# EAGLE design Adafruit Latching Relay FeatherWing (EAGLE 6.6.0)
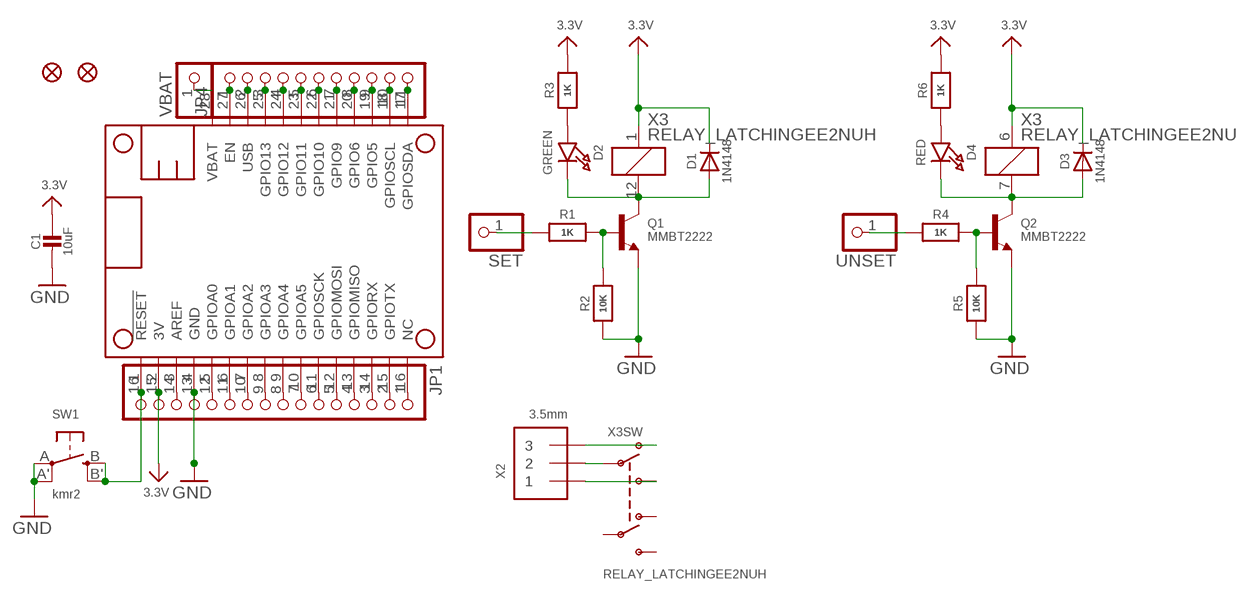
[diagram p0: schematic, sheet 1]

## Parts
C1  10uF  CAP_CERAMIC0805-NOOUTLINE  [0805-NO]
D1  1N4148  DIODESOD-323  [SOD-323]
D2  GREEN  LED0805_NOOUTLINE  [CHIPLED_0805_NOOUTLINE]
D3  1N4148  DIODESOD-323  [SOD-323]
D4  RED  LED0805_NOOUTLINE  [CHIPLED_0805_NOOUTLINE]
FID2  FIDUCIAL""  [FIDUCIAL_1MM]
FID3  FIDUCIAL""  [FIDUCIAL_1MM]
JP1  HEADER-1X16ROUND  [1X16_ROUND]
JP4  HEADER-1X11  [1X11_ROUND]
MS1  MICROSHIELD  [MICROSHIELD]
Q1  MMBT2222  TRANSISTOR_NPN  [SOT23-R]
Q2  MMBT2222  TRANSISTOR_NPN  [SOT23-R]
R1  1K  RESISTOR0805_NOOUTLINE  [0805-NO]
R2  10K  RESISTOR0805_NOOUTLINE  [0805-NO]
R3  1K  RESISTOR0805_NOOUTLINE  [0805-NO]
R4  1K  RESISTOR0805_NOOUTLINE  [0805-NO]
R5  10K  RESISTOR0805_NOOUTLINE  [0805-NO]
R6  1K  RESISTOR0805_NOOUTLINE  [0805-NO]
SET  HEADER-1X1ROUND  [1X01_ROUND]
SW1  kmr2  SWITCH_TACT_SMT4.6X2.8  [BTN_KMR2_4.6X2.8]
UNSET  HEADER-1X1ROUND  [1X01_ROUND]
VBAT  HEADER-1X1ROUND  [1X01_ROUND]
X2  3.5mm  TERMBLOCK_1X3  [TERMBLOCK_1X3-3.5MM]
X3  RELAY_LATCHINGEE2NUH  [RELAY_EE2_LATCH]

## Nets
3.3V: C1.1 D1.C D3.C JP1.15 MS1.2(3V) R3.2 R6.2 X3.1 X3.6
COM1 [HV]: X2.2 X3.9(SW:P1)
GND: C1.2 JP1.13 MS1.4(GND) Q1.2(E) Q2.2(E) R2.1 R5.1 SW1.A'(P1) SW1.A(P)
N$1: D1.A D2.C Q1.3(C) X3.12
N$2: JP1.1 MS1.16(NC)
N$3: JP1.2 MS1.15(GPIOTX)
N$4: JP1.3 MS1.14(GPIORX)
N$5: JP1.4 MS1.13(GPIOMISO)
N$6: JP1.5 MS1.12(GPIOMOSI)
N$7: JP1.6 MS1.11(GPIOSCK)
N$8: JP1.7 MS1.10(GPIOA5)
N$9: JP1.8 MS1.9(GPIOA4)
N$10: JP1.9 MS1.8(GPIOA3)
N$11: JP1.10 MS1.7(GPIOA2)
N$12: JP1.11 MS1.6(GPIOA1)
N$13: JP1.12 MS1.5(GPIOA0)
N$14: JP4.1 MS1.27(EN)
N$15: JP4.3 MS1.25(GPIO13)
N$16: JP4.4 MS1.24(GPIO12)
N$17: JP4.5 MS1.23(GPIO11)
N$18: JP4.6 MS1.22(GPIO10)
N$19: JP4.7 MS1.21(GPIO9)
N$20: JP4.8 MS1.20(GPIO6)
N$21: JP4.9 MS1.19(GPIO5)
N$22: Q1.1(B) R1.2 R2.2
N$23: JP1.14 MS1.3(AREF)
N$24: R1.1 SET.1
N$25: D3.A D4.C Q2.3(C) X3.7
N$26: D2.A R3.1
N$27: Q2.1(B) R4.2 R5.2
N$28 [HV]: X2.3 X3.10(SW:O1)
N$29: R4.1 UNSET.1
N$30: D4.A R6.1
NO1 [HV]: X2.1 X3.8(SW:S1)
RESET: JP1.16 MS1.1(!RESET) SW1.B'(S1) SW1.B(S)
SCL: JP4.10 MS1.18(GPIOSCL)
SDA: JP4.11 MS1.17(GPIOSDA)
USB: JP4.2 MS1.26(USB)
VBAT: MS1.28(VBAT) VBAT.1
Unconnected: X3.3(SW:O2) X3.4(SW:P2) X3.5(SW:S2)

## Library data of the parts
C1 = microbuilder:CAP_CERAMIC: Ceramic Capacitors For new designs, use the packages preceded by an '_' character since they are more reliable: The following footprints should be used on most boards: _0402 - Standard footprint for regular board layouts _0603 - Standard footprint for regular board layouts _0805 - Standard footprint for regular board layouts _1206 - Standard footprint for regular board layouts For extremely tight-pitch boards where space is at a premium, the following 'micro-pitch' footprints can be used (smaller pads, no silkscreen outline, etc.): _0402MP - Micro-pitch footprint for very dense/compact boards _0603MP - Micro-pitch footprint for very dense/compact boards _0805MP - Micro-pitch footprint for very dense/compact boards _1206MP - Micro-pitch footprint for very dense/compact boards
D1 D3 = microbuilder:DIODE: Diode SMA Model Volts Amps Type Vf Ir Digikey # Notes SSA34-E3 40V 3A Schottky 480mV @ 3A 200uA @ 40V SSA34-E3/61TGITR-ND CDBA120-G 20V 1A Schottky 500mV @ 1A 500uA @ 20V 641-1014-6-ND REEL MBRA210 10V 2A Schottky 350mV @ 2A 700uA @ 10V MBRA210LT3 SOD-123 Model Volts Amps Type Vf Ir Order # Notes BAT54T1G 30V 200mA Schottky 800mV @ 200mA 2uA @ 25V BAT54T1GOSTR-ND B0530W 30V 500mA Schottky 430mV @ 500mA 130uA @ 30V B0530W-FDICT-ND REEL MBR120 20V 1A Schottky 340mV @ 1A MBR120VLSFT1GOSCT-ND SOD-323 Model Volts Amps Type Vf Ir Order # Notes PMEG2005EJ 20V 500mA Schottky 355mV @ 500mA 568-4110-1-ND ZLLS410 10V 570mA Schottky 380mV @ 570mA ZLLS410CT-ND 1N4148WS 75V 150mA Silicon/Simple 1V 1N4148WSFSCT-ND REEL SOD-523 Model Volts Amps Type Vf Ir Order # Notes BAT54XV2 30V 200mA Schottky 0.8V @ 100mA BAT54XV2CT-ND TB751S 30V 30mA Schottky RB751S-40TE61CT-ND SOT23-R/W (R = Solder Paste/Reflow Ovens, W = Hand-Soldering) Model Volts Amps Type Vf Ir Order # Notes BAT54FILM 40V 300mA Schottky 497-7162-1-ND POWERDI-5 Model Volts Amps Type Vf Ir Order # Notes PDS560 60V 5A Schottky 670mV @ 5A 150uA @ 60V PDS560DICT-ND
D2 D4 = microbuilder:LED: LED 0603 - 0603 Surface Mount Package 2mA: Green LED - Low Power (3.9mcd, 2ma, 1.7Vf) - Digikey: 475-2709-2-ND Orange LED - Low Power (9.8mcd, 2ma, 1.8Vf) - Digikey: 475-1194-2-ND Red LED - Low Power (5mcd, 2ma, 1.8Vf) - Digikey: 475-1195-2-ND Yellow LED - Low Power (7mcd, 2ma, 1.8Vf) - Digikey: 475-1196-2-ND 5mA: Blue LED - Low Power (17mcd, 5ma, 2.9Vf) - Digikey: LNJ937W8CRACT-ND 0805 - 0805 Surface Mount Package 2mA: Red LED (8.8mcd, 2mA, 1.8Vf, Clear) - Low Power [Digikey: 475-2510-1-ND] Green LED (5mcd, 2mA, 1.8Vf, Clear) - Low Power [Digikey: 475-2730-1-ND] Yellow LED (11.3mcd, 2mA, 1.8Vf, Clear) - Low Power [Digikey: 475-2555-1-ND] 20mA: Red LED (104mcd, 20mA, Diffused) - LS R976 [Digikey: 475-1278-6-ND] Red LED (12mcd, 20mA, 2.0Vf, Clear) - APT2012EC [Digikey: 754-1128-1-ND] Green LED (15mcd, 20mA, 2.2Vf, Clear) - APT2012GC [Digikey: 754-1131-1-ND] Orange LED (160mcd, 20mA, 2.1Vf, Clear) - APT2012SECK [Digikey: 754-1130-1-ND] 1206 - 1206 Surface Mount Package Green LED (26mcd, 20mA, Diffused) - LG N971 [Digikey: 475-1407-6-ND] Red LED (15mcd, 20mA, Diffused) - LH N974 [Digikey: 475-1416-6-ND] Cree - Cree High-Power Surface Mount LEDs XPEBWT-L1-0000-00D50 - White 111lm 350mA 2.9Vf 6200K 110° XTEAWT-00-0000-00000LEE3 - White 114lm 350mA 2.85Vf 5000K 115° Everlight - Everlight 45-21 Series Surface Mount LEDs 45-21/QK2C-B2832AC2CB2/2T - Warm White 2000mcd 20mA 3.25Vf 3050K 120° 45-21/LK2C-B38452C4CB2/2T - Nuetral White 2000mcd 20mA 3.25Vf 4150K 120° 45-21/LK2C-B50634C6CB2/2T - Cold White 2200mcd 20mA 3.25Vf 5650K 120° PLCC2 Reverse Mount LS T77K-J1L2-1-0-2-R18-Z - Red 11.25mcd 2mA 1.8Vf 630nm 120° LO T77K-L1M2-24-Z - Orange 19.6mcd 2mA 1.8Vf 606nm 120° LY T77K-K2M1-26-Z - Yellow 15.7mcd 2mA 1.8Vf 587nm 120°
FID2 FID3 = microbuilder:FIDUCIAL: Fiducial Alignment Points Various fiducial points for machine vision alignment.; BOM: EXCLUDE
JP1 = microbuilder:HEADER-1X16: PIN HEADER
JP4 = microbuilder:HEADER-1X11
MS1 = microbuilder:MICROSHIELD
Q1 Q2 = microbuilder:TRANSISTOR_NPN: NPN Transistor Transistor (NPN) 500mA 45V - BC817 [Digikey: 568-1631-1-ND] Transistor (NPN) 500mA 45V - BC817,215 [Mouser: 771-BC817-T/R] SOT23-R - SOT23 footprint optimised for use with solder paste and reflow ovens. SOT23-W - SOT23 footprint optimised for hand-soldering (larger pads).
R1-R6 = microbuilder:RESISTOR: Resistors For new designs, use the packages preceded by an '_' character since they are more reliable: The following footprints should be used on most boards: _0402 - Standard footprint for regular board layouts _0603 - Standard footprint for regular board layouts _0805 - Standard footprint for regular board layouts _1206 - Standard footprint for regular board layouts For extremely tight-pitch boards where space is at a premium, the following 'micro-pitch' footprints can be used (smaller pads, no silkscreen outline, etc.): _0402MP - Micro-pitch footprint for very dense/compact boards _0603MP - Micro-pitch footprint for very dense/compact boards _0805MP - Micro-pitch footprint for very dense/compact boards _1206MP - Micro-pitch footprint for very dense/compact boards
SET UNSET VBAT = microbuilder:HEADER-1X1: PIN HEADER
SW1 = microbuilder:SWITCH_TACT_SMT: SMT Tact Switches 6x6mm - Digikey: P12940SCT-ND KMR2 (4.6x2.8mm) - Digikey: 401-1426-1-ND EVQ-PQHB55 - Light Touch, 160GF (4.5x4.5mm) - Digikey: P8090SCT-ND KMT0 - KMT021 NGJ LHS (etc.) IP68/Waterproof - Digikey: CKN10289CT-ND
X2 = microbuilder:TERMBLOCK_1X3: 3.5mm Terminal block http://www.ladyada.net/library/pcb/eaglelibrary.html
X3 = microbuilder:RELAY_LATCHING

## Net classes
1 HV: width 0.406 mm, drill 0.381 mm, clearance 1.016 mm

## Board
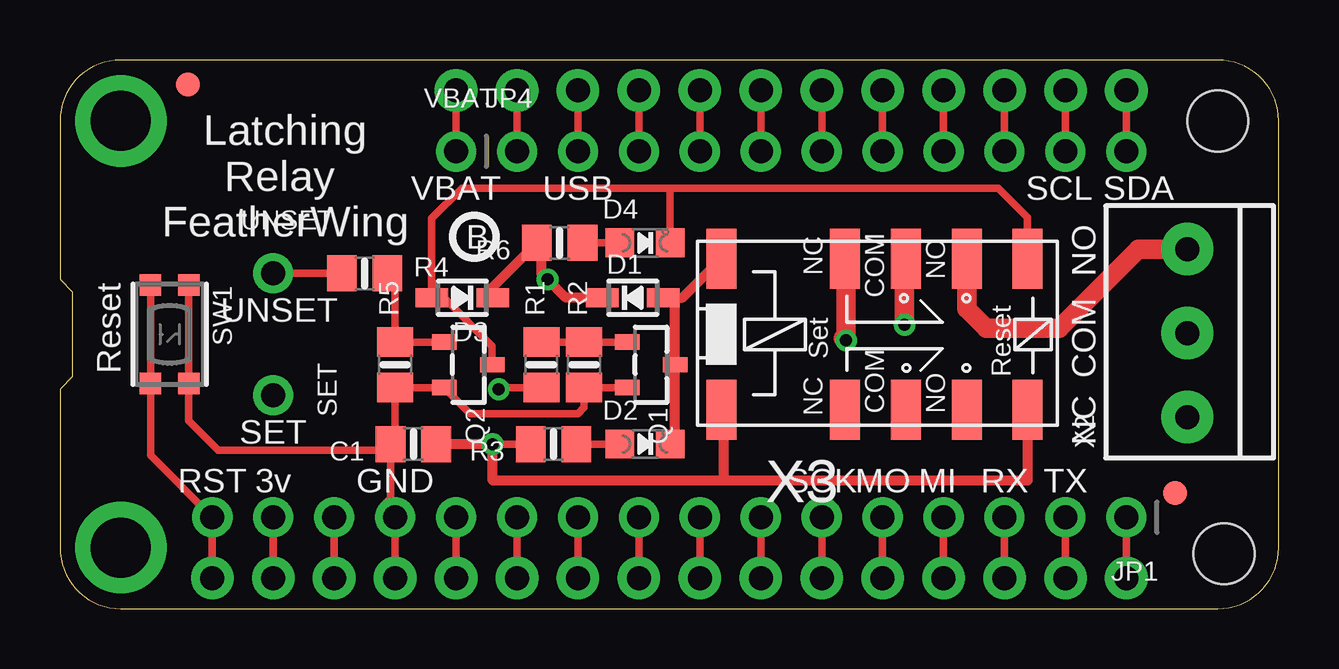
[diagram p1: board, top side]
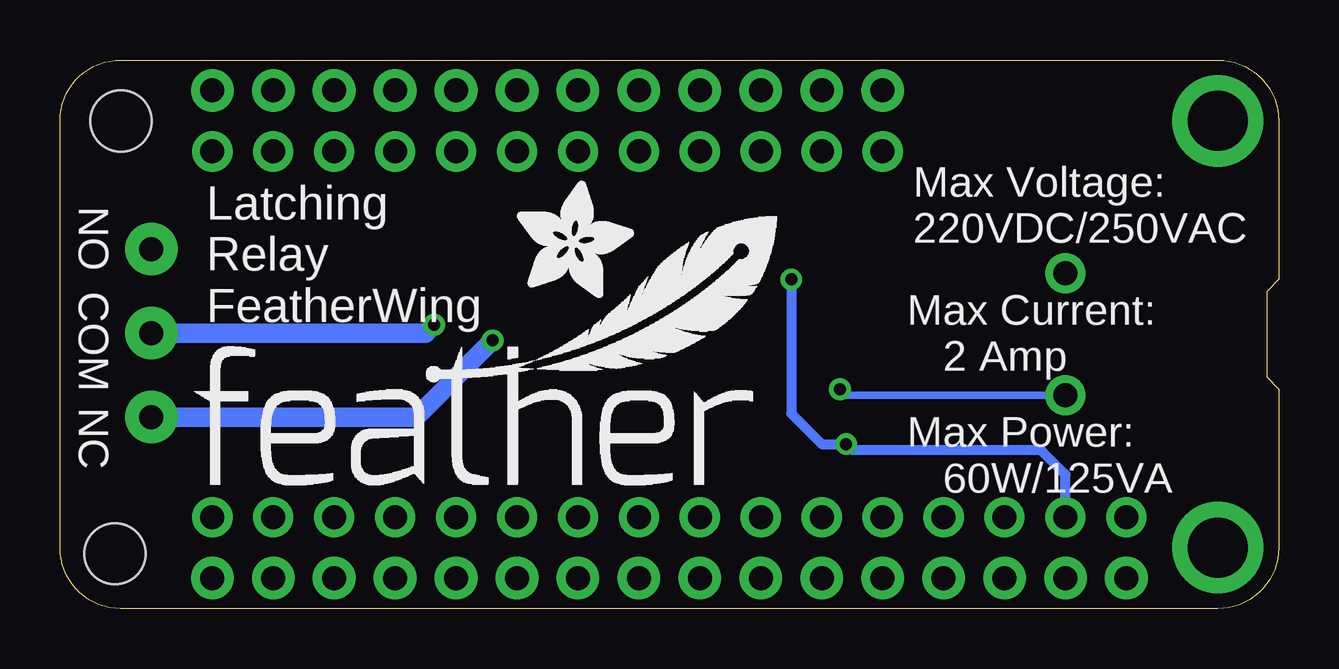
[diagram p2: board, bottom side, seen from below]

Size 50.8 x 22.86 mm. Coordinates in mm from the lower left corner, seen from the top.
Copper layers (1*16): Top 0.035mm / dielectric 1.5mm / Bottom 0.035mm
Design rules "adafruit": minimum track width 8mil, minimum drill 15.5mil, track to track 8mil, track to pad 8mil, pad to pad 8mil, via to via 8mil, smd to smd 8mil, copper to edge 10mil, drill to drill 8mil, minimum pad ring 10mil, minimum via ring 8mil, stop-mask expansion 2mil, vias tented up to drill 20mil, thermal gap 10mil

### Footprints (pad centres in the part's own frame; a part is rotated, then mirrored left to right if it is on the bottom)
0805-NO = smd 1.24 x 1.5: 1 -0.95,0; 2 0.95,0
SOD-323 = smd 1.35 x 0.8: A 1.27,0; C -1.27,0
CHIPLED_0805_NOOUTLINE = smd 1.2 x 1.2: A 0,-1.05; C 0,1.05
FIDUCIAL_1MM = smd 1 x 1: 1 0,0
1X16_ROUND = drill 1 pad 1.676: 1 -19.05,0; 2 -16.51,0; 3 -13.97,0; 4 -11.43,0; 5 -8.89,0; 6 -6.35,0; 7 -3.81,0; 8 -1.27,0; 9 1.27,0; 10 3.81,0; 11 6.35,0; 12 8.89,0; 13 11.43,0; 14 13.97,0; 15 16.51,0; 16 19.05,0
1X11_ROUND = drill 1 pad 1.676: 1 -12.7,0; 2 -10.16,0; 3 -7.62,0; 4 -5.08,0; 5 -2.54,0; 6 0,0; 7 2.54,0; 8 5.08,0; 9 7.62,0; 10 10.16,0; 11 12.7,0
MICROSHIELD = drill 1 pad 1.778: 1 6.35,1.27; 2 8.89,1.27; 3 11.43,1.27; 4 13.97,1.27; 5 16.51,1.27; 6 19.05,1.27; 7 21.59,1.27; 8 24.13,1.27; 9 26.67,1.27; 10 29.21,1.27; 11 31.75,1.27; 12 34.29,1.27; 13 36.83,1.27; 14 39.37,1.27; 15 41.91,1.27; 16 44.45,1.27; 17 44.45,21.59; 18 41.91,21.59; 19 39.37,21.59; 20 36.83,21.59; 21 34.29,21.59; 22 31.75,21.59; 23 29.21,21.59; 24 26.67,21.59; 25 24.13,21.59; 26 21.59,21.59; 27 19.05,21.59; 28 16.51,21.59 | drill 2.5 pad 3.81: P$1 2.54,20.32; P$2 2.54,2.54 | hole 2.54: 48.26,20.32; 48.514,2.286
SOT23-R = smd 0.635 x 1.016: 1 -0.95,-1; 2 0.95,-1; 3 0,1
1X01_ROUND = drill 1 pad 1.676: 1 0,0
BTN_KMR2_4.6X2.8 = smd 0.9 x 0.9: A 2.05,0.8; A' -2.05,0.8; B 2.05,-0.8; B' -2.05,-0.8
TERMBLOCK_1X3-3.5MM = drill 1 pad 2.184: 1 3.55,0; 2 0.05,0; 3 -3.45,0
RELAY_EE2_LATCH = smd 1.25 x 2.5: 1 -6.2,-3.15; 3 -1.07,-3.15; 4 1.47,-3.15; 5 4.01,-3.15; 6 6.55,-3.15; 7 6.55,3.15; 8 4.01,3.15; 9 1.47,3.15; 10 -1.07,3.15; 12 -6.2,3.15

### Placement (x,y rotation side)
C1  14.73,6.86 180 top
D1  23.88,12.95 0 top
D2  24.38,6.86 270 top
D3  16.76,12.95 180 top
D4  24.38,15.24 270 top
FID2  5.33,21.84 0 top
FID3  46.48,4.83 0 top
JP1  25.4,3.81 180 top
JP4  31.75,19.05 0 top
MS1  0,0 0 top
Q1  24.64,10.16 270 top
Q2  17.02,10.16 270 top
R1  20.07,10.16 90 top
R2  21.84,10.16 90 top
R3  20.57,6.86 180 top
R4  12.7,13.97 0 top
R5  13.97,10.16 90 top
R6  20.83,15.24 180 top
SET  8.89,8.89 270 top
SW1  4.57,11.43 270 top
U$6  [FEATHERLOGO]  45.21,5.08 0 bottom
U$8  [PCBFEAT-REV-040]  17.27,15.49 0 top
U$9  [ADAFRUIT_5MM]  31.75,12.95 0 bottom
UNSET  8.89,13.97 0 top
VBAT  16.51,19.05 0 top
X2  46.99,11.43 90 top
X3  33.78,11.43 0 top

### Tracks (layer width: path | path; a pad name or v marks a point on that pad's centre or on a via)
3.3V  (via drill 0.5)
  Top 0.305: JP1.15 MS1.2 | 20.07,15.05 R6.2 | R3.2 v18.03,6.86
  Top 0.406: D3.C 18.03,13.4 R6.2 | 20.07,15.05 20.07,13.97 v20.32,13.72 21.08,12.95 D1.C | C1.1 v18.03,6.86 18.03,5.33 27.69,5.33 | X3.6 40.33,5.33 27.69,5.33 | 27.69,5.33 27.69,8.28 X3.1
  Bottom 0.305: 17.78,6.6 v18.03,6.86
  Bottom 0.406: v20.32,13.72 20.32,8.13 19.05,6.86 v18.03,6.86 | JP1.15 8.89,5.59 9.91,6.6 17.78,6.6
COM1  (via drill 0.5)
  Top 0.813: X3.9 35.21,14.58 v35.21,11.82
  Bottom 0.813: v35.21,11.82 35.55,11.48 X2.2
GND
  Top 0.305: MS1.4 JP1.13 13.48,4.3 13.78,4.6 C1.2 | Q1.2 R2.1 21.84,8.38 21.59,8.13 17.1,8.13 Q2.2 R5.1 13.97,7.05 C1.2 | SW1.A' SW1.A 5.37,7.84 6.6,6.6 13.53,6.6 C1.2
N$1
  Top 0.406: D1.A 25.65,12.95 | 25.65,12.95 25.96,12.95 X3.12 | 25.65,12.95 25.64,12.94 Q1.3 25.64,7.06 D2.C
N$2
  Top 0.305: JP1.1 MS1.16
N$3
  Top 0.305: JP1.2 MS1.15
N$4
  Top 0.305: MS1.14 JP1.3
N$5
  Top 0.305: JP1.4 MS1.13
N$6
  Top 0.305: MS1.12 JP1.5
N$7
  Top 0.305: JP1.6 MS1.11
N$8
  Top 0.305: MS1.10 JP1.7
N$9
  Top 0.305: MS1.9 JP1.8
N$10
  Top 0.305: JP1.9 MS1.8
N$11
  Top 0.305: MS1.7 JP1.10
N$12
  Top 0.305: MS1.6 JP1.11
N$13
  Top 0.305: MS1.5 JP1.12
N$14
  Top 0.305: JP4.1 MS1.27
N$15
  Top 0.305: JP4.3 MS1.25
N$16
  Top 0.305: JP4.4 MS1.24
N$17
  Top 0.305: JP4.5 MS1.23
N$18
  Top 0.305: JP4.6 MS1.22
N$19
  Top 0.305: JP4.7 MS1.21
N$20
  Top 0.305: JP4.8 MS1.20
N$21
  Top 0.305: JP4.9 MS1.19
N$22
  Top 0.305: Q1.1 R2.2 R1.2
N$23
  Top 0.305: MS1.3 JP1.14
N$24  (via drill 0.5)
  Top 0.305: v18.29,9.14 18.35,9.21 R1.1
  Bottom 0.305: SET.1 18.03,8.89 v18.29,9.14
N$25
  Top 0.305: Q2.3 18.02,10.94 16,12.95 D3.A 15.49,16.26 16.76,17.53 25.4,17.53 | D4.C 25.43,17.49 25.4,17.53 | 25.4,17.53 39.12,17.53 40.33,16.31 X3.7
N$26
  Top 0.305: R3.1 D2.A
N$27
  Top 0.305: Q2.1 R5.2 13.97,13.65 R4.2
N$28  (via drill 0.5)
  Top 0.813: 32.67,11.28 v32.77,11.18 32.77,14.58 X3.10
  Bottom 0.813: v32.77,11.18 35.96,7.98 X2.3
N$29
  Top 0.305: UNSET.1 R4.1
N$30
  Top 0.305: R6.1 D4.A
NO1
  Top 0.813: X3.8 37.79,12.5 38.61,11.68 41.66,11.68 44.95,14.98 X2.1
RESET
  Top 0.305: MS1.1 JP1.16 3.77,6.39 SW1.B SW1.B'
SCL
  Top 0.305: JP4.10 MS1.18
SDA
  Top 0.305: MS1.17 JP4.11
USB
  Top 0.305: JP4.2 MS1.26
VBAT
  Top 0.305: MS1.28 VBAT.1

### Text on the board
tPlace: Latching / Relay / FeatherWing | VBAT | USB | SCL | SDA | NO | COM | Reset | UNSET | NC | SET | RST | 3v | GND | SCK | MO | MI | RX | TX
bPlace: NO | Max Voltage: / 220VDC/250VAC | COM | Latching / Relay / FeatherWing | Max Current: / 2 Amp | NC | Max Power: / 60W/125VA